# Altium schematic sheet reciever.SchDoc
size A4
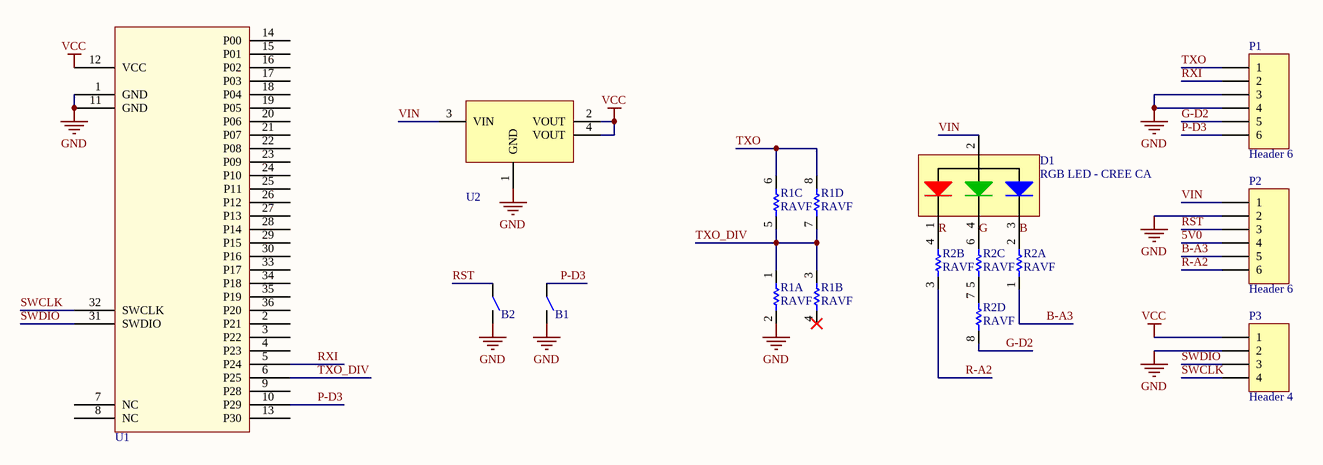
[diagram p0: reciever.SchDoc]

## Parts
B1  Tactile Button  [TACTILE BUTTON]  (value not drawn)
B2  Tactile Button  [TACTILE BUTTON]  (value not drawn)
D1  RGB LED - CREE CA  [PLCC4-RGBLED]
P1  Header 6  [HDR1X6]
P2  Header 6  [HDR1X6]
P3  Header 4  [HDR1X4]
R1  RAVF  [1206 quad res]  (parts A,B,C,D of 4)
R2  RAVF  [1206 quad res]  (parts A,B,C,D of 4)
U1  Core51822 (B)  [Core51822 (B)]  (value not drawn)
U2  NCP1117  [SOT230P700X180-4N]  (value not drawn)

## Nets
GND: B1.2 B2.2 P1.3 P1.4 P2.2 P3.2 R1.2 U1.1(GND) U1.11(GND) U2.1(GND)
VCC: P3.1 U1.12(VCC) U2.2(VOUT) U2.4(VOUT)
5V0: P2.4
B: D1.3(B) R2.2
B-A3: P2.5 R2.1
G: D1.4(G) R2.6
G-D2: P1.5 R2.8
P-D3: B1.1 P1.6 U1.10(P29)
R: D1.1(R) R2.4
R-A2: P2.6 R2.3
RST: B2.1 P2.3
RXI: P1.2 U1.5(P24)
SWCLK: P3.4 U1.32(SWCLK)
SWDIO: P3.3 U1.31(SWDIO)
TXO: P1.1 R1.6 R1.8
TXO_DIV: R1.1 R1.3 R1.5 R1.7 U1.6(P25)
VIN: D1.2(CA) P2.1 U2.3(VIN)
NetR2_5: R2.5 R2.7

Not connected (* = marked no-connect by the designer): R1 4(2)*; U1 2(P21) 3(P22) 4(P23) 7(NC) 8(NC) 9(P28) 13(P30) 14(P00) 15(P01) 16(P02) 17(P03) 18(P04) 19(P05) 20(P06) 21(P07) 22(P08) 23(P09) 24(P10) 25(P11) 26(P12) 27(P13) 28(P14) 29(P15) 30(P16) 33(P17) 34(P18) 35(P19) 36(P20)

## Library data of the parts
D1 = RGB LED - CREE CA: Tri Colour CA RGB LEDs - CLV1A-FKB
P1 P2 = Header 6: Header, 6-Pin; LatestRevisionDate: 17-Jul-2002; LatestRevisionNote: Re-released for DXP Platform.; Publisher: Altium Limited
P3 = Header 4: Header, 4-Pin; LatestRevisionDate: 17-Jul-2002; LatestRevisionNote: Re-released for DXP Platform.; Publisher: Altium Limited
R1 R2 = RAVF_Multi: RAVF164DJT100R
U1 = Core51822 (B): NRF51822 (B)